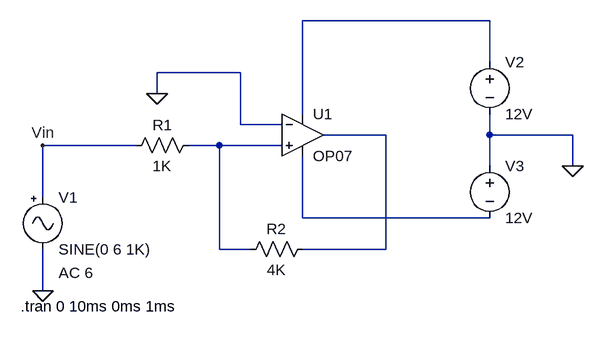
[diagram p0: schematic SCHMITT TRIGGER.asc]
SCHMITT TRIGGER.asc, the LTspice schematic file:
Version 4
SHEET 1 880 680
WIRE 704 -64 416 -64
WIRE 704 0 704 -64
WIRE 320 16 192 16
WIRE 192 48 192 16
WIRE 416 80 416 -64
WIRE 320 96 320 16
WIRE 384 96 320 96
WIRE 544 112 448 112
WIRE 704 112 704 80
WIRE 832 112 704 112
WIRE 160 128 16 128
WIRE 288 128 240 128
WIRE 384 128 288 128
WIRE 704 160 704 112
WIRE 832 160 832 112
WIRE 16 208 16 128
WIRE 416 240 416 144
WIRE 704 240 416 240
WIRE 288 288 288 128
WIRE 336 288 288 288
WIRE 544 288 544 112
WIRE 544 288 416 288
WIRE 16 352 16 288
FLAG 192 48 0
FLAG 16 352 0
FLAG 832 160 0
FLAG 16 128 Vin
SYMBOL OpAmps\\OP07 416 48 R0
SYMATTR InstName U1
SYMBOL res 256 112 R90
WINDOW 0 0 56 VBottom 2
WINDOW 3 32 56 VTop 2
SYMATTR InstName R1
SYMATTR Value 1K
SYMBOL res 432 272 R90
WINDOW 0 0 56 VBottom 2
WINDOW 3 32 56 VTop 2
SYMATTR InstName R2
SYMATTR Value 4K
SYMBOL voltage 704 -16 R0
SYMATTR InstName V2
SYMATTR Value 12V
SYMBOL voltage 704 144 R0
SYMATTR InstName V3
SYMATTR Value 12V
SYMBOL Misc\\signal 16 192 R0
WINDOW 123 24 132 Left 2
WINDOW 39 0 0 Left 0
SYMATTR InstName V1
SYMATTR Value SINE(0 6 1K)
SYMATTR Value2 AC 6
TEXT -18 376 Left 2 !.tran 0 10ms 0ms 1ms

The netlist it stands for:
* SCHMITT TRIGGER.asc
XU1 N003 0 N001 N004 N002 LT1001  ; OP07, pins In+ In- V+ V- OUT
R1 N003 Vin 1K
R2 N002 N003 4K
V2 N001 0 12V
V3 0 N004 12V
V1 Vin 0 SINE(0 6 1K) AC 6
.tran 0 10ms 0ms 1ms
.lib LTC.lib
.backanno
.end